# Altium schematic sheet (2) Controller A20_ESP32.SchDoc
size 355 x 228 mm; SheetNumber: 2; SheetTotal: 6
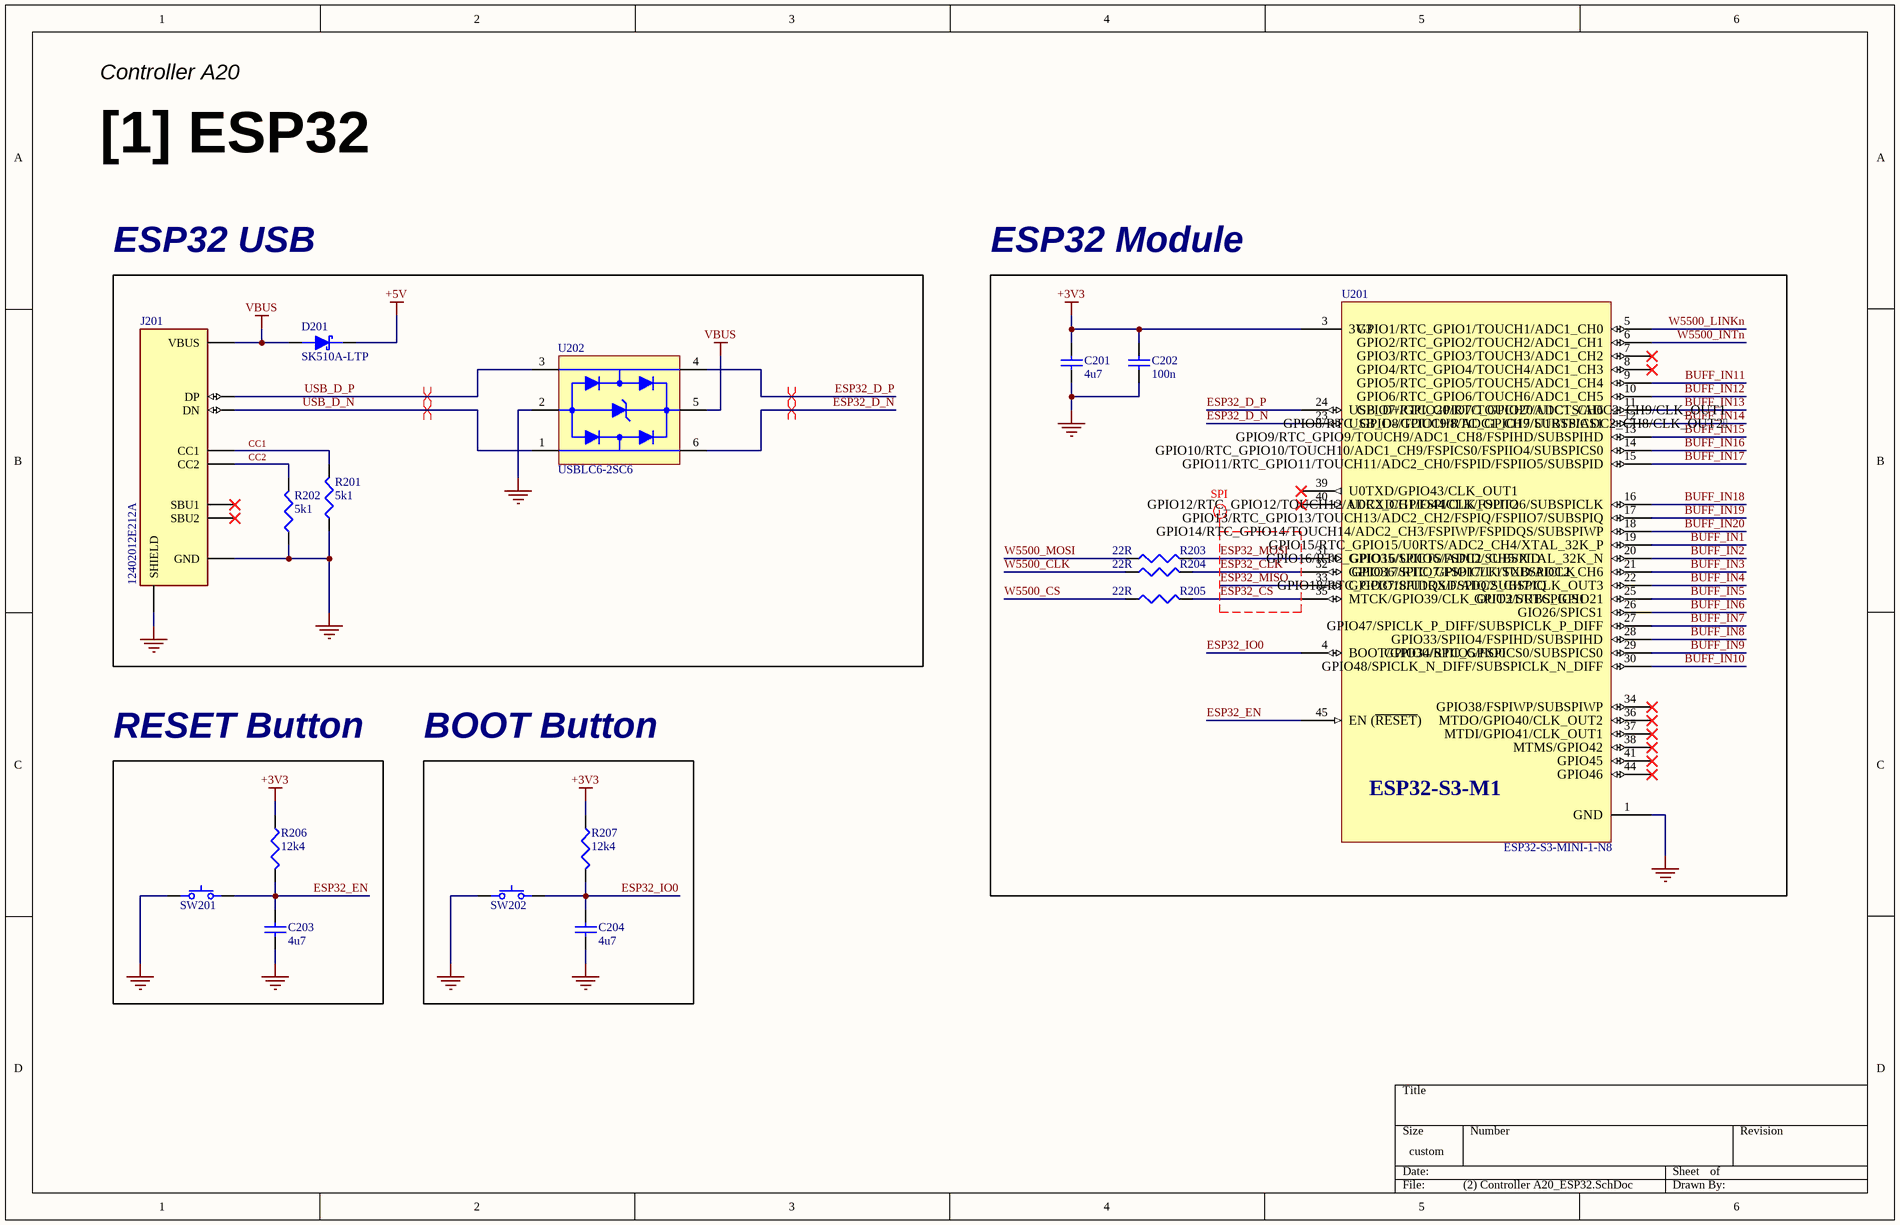
[diagram p0: (2) Controller A20_ESP32.SchDoc]

## Parts
C201  4u7  [C0805]
C202  100n  [C0603]
C203  4u7  [C0805]
C204  4u7  [C0805]
D201  SK510A-LTP  [DO-214AC(SMA)]
J201  12402012E212A  [USB-C Female 16P]
R201  5k1  [R0603]
R202  5k1  [R0603]
R203  22R  [R0402]
R204  22R  [R0402]
R205  22R  [R0402]
R206  12k4  [R0603]
R207  12k4  [R0603]
SW201  SKRPANE010  [SMD Tactile Switch]  (value not drawn)
SW202  SKRPANE010  [SMD Tactile Switch]  (value not drawn)
U201  ESP32-S3-MINI-1-N8  [ESP32-S3-MINI-1-N8]
U202  USBLC6-2SC6  [SOT23-6L]

## Blocks framed on the sheet
ESP32 USB: D201 J201 R201 R202 U202
ESP32 Module: C201 C202 R203-R205 U201
RESET Button: C203 R206 SW201
BOOT Button: C204 R207 SW202

## Nets
+3V3: C201.2 C202.2 R206.2 R207.2 U201.3(3V3)
+5V: D201.2
GND: C201.1 C202.1 C203.1 C204.1 J201.A1B12/B1A12(GND) J201.SH(SHIELD) R201.1 R202.1 SW201.2 SW202.2 U201.1(GND) U202.2
VBUS: D201.1 J201.A4B9/_B4A9(VBUS) U202.5
BUFF_IN1: U201.19(GPIO15/RTC_GPIO15/U0RTS/ADC2_CH4/XTAL_32K_P)
BUFF_IN2: U201.20(GPIO16/RTC_GPIO16/U0CTS/ADC2_CH5/XTAL_32K_N)
BUFF_IN3: U201.21(GPIO17/RTC_GPIO17/U1TXD/ADC2_CH6)
BUFF_IN4: U201.22(GPIO18/RTC_GPIO18/U1RXD/ADC2_CH7/CLK_OUT3)
BUFF_IN5: U201.25(GPIO21/RTC_GPIO21)
BUFF_IN6: U201.26(GIO26/SPICS1)
BUFF_IN7: U201.27(GPIO47/SPICLK_P_DIFF/SUBSPICLK_P_DIFF)
BUFF_IN8: U201.28(GPIO33/SPIIO4/FSPIHD/SUBSPIHD)
BUFF_IN9: U201.29(GPIO34/SPIIO5/FSPICS0/SUBSPICS0)
BUFF_IN10: U201.30(GPIO48/SPICLK_N_DIFF/SUBSPICLK_N_DIFF)
BUFF_IN11: U201.9(GPIO5/RTC_GPIO5/TOUCH5/ADC1_CH4)
BUFF_IN12: U201.10(GPIO6/RTC_GPIO6/TOUCH6/ADC1_CH5)
BUFF_IN13: U201.11(GPIO7/RTC_GPIO7/TOUCH7/ADC1_CH6)
BUFF_IN14: U201.12(GPIO8/RTC_GPIO8/TOUCH8/ADC1_CH7/SUBSPICS1)
BUFF_IN15: U201.13(GPIO9/RTC_GPIO9/TOUCH9/ADC1_CH8/FSPIHD/SUBSPIHD)
BUFF_IN16: U201.14(GPIO10/RTC_GPIO10/TOUCH10/ADC1_CH9/FSPICS0/FSPIIO4/SUBSPICS0)
BUFF_IN17: U201.15(GPIO11/RTC_GPIO11/TOUCH11/ADC2_CH0/FSPID/FSPIIO5/SUBSPID)
BUFF_IN18: U201.16(GPIO12/RTC_GPIO12/TOUCH12/ADC2_CH1/FSPICLK/FSPIIO6/SUBSPICLK)
BUFF_IN19: U201.17(GPIO13/RTC_GPIO13/TOUCH13/ADC2_CH2/FSPIQ/FSPIIO7/SUBSPIQ)
BUFF_IN20: U201.18(GPIO14/RTC_GPIO14/TOUCH14/ADC2_CH3/FSPIWP/FSPIDQS/SUBSPIWP)
CC1: J201.A5(CC1) R201.2
CC2: J201.B5(CC2) R202.2
ESP32_CLK: R204.2 U201.32(GPIO36/SPIIO7/FSPICLK/SUBSPICLK)
ESP32_CS: R205.2 U201.35(MTCK/GPIO39/CLK_OUT3/SUBSPICS1)
ESP32_D_N: U201.23(USB_D-/GPIO19/RTC_GPIO19/U1RTS/ADC2_CH8/CLK_OUT2) U202.6
ESP32_D_P: U201.24(USB_D+/GPIO20/RTC_GPIO20/U1CTS/ADC2_CH9/CLK_OUT1) U202.4
ESP32_EN: C203.2 R206.1 SW201.1 U201.45(EN_(~{RESET}))
ESP32_IO0: C204.2 R207.1 SW202.1 U201.4(BOOT/GPIO0/RTC_GPIO0)
ESP32_MISO: U201.33(GPIO37/SPIDQS/FSPIQ/SUBSPIQ)
ESP32_MOSI: R203.2 U201.31(GPIO35/SPIIO6/FSPID/SUBSPID)
USB_D_N: J201.A7/B7(DN) U202.1
USB_D_P: J201.A6/B6(DP) U202.3
W5500_CLK: R204.1
W5500_CS: R205.1
W5500_INTn: U201.6(GPIO2/RTC_GPIO2/TOUCH2/ADC1_CH1)
W5500_LINKn: U201.5(GPIO1/RTC_GPIO1/TOUCH1/ADC1_CH0)
W5500_MOSI: R203.1

Not connected (* = marked no-connect by the designer): J201 A8(SBU1)* B8(SBU2)*; U201 7(GPIO3/RTC_GPIO3/TOUCH3/ADC1_CH2)* 8(GPIO4/RTC_GPIO4/TOUCH4/ADC1_CH3)* 34(GPIO38/FSPIWP/SUBSPIWP)* 36(MTDO/GPIO40/CLK_OUT2)* 37(MTDI/GPIO41/CLK_OUT1)* 38(MTMS/GPIO42)* 39(U0TXD/GPIO43/CLK_OUT1)* 40(U0RXD/GPIO44/CLK_OUT2)* 41(GPIO45)* 44(GPIO46)*

## Layout directives
differential pair; differential pair class USB90: USB_D_P
differential pair; differential pair class USB90; rule Impedance Constraint [Min = 85.00    Max = 95.00    ]: ESP32_D_N, ESP32_D_P, USB_D_N, USB_D_P
rule Impedance Constraint [Min = 45.00    Max = 55.00    ]; net class SPI: ESP32_CLK, ESP32_CS, ESP32_MISO, ESP32_MOSI

## Notes on the sheet
- Controller A20
- [1] ESP32
- (in symbol ESP32-S3-MINI-1-N8) ESP32-S3-M1

## Library data of the parts
C201 C203 C204 = CAP 4.7uF 50V: 4.7 µF ±20% 50V Ceramic Capacitor X7R 0805 (2012 Metric); Manufacturer: Murata Electronics; Mfr. Part #: GRM21BZ71H475ME15K; Qty.: 1; Ext. Price: 0.27; Supplier: DigiKey; Supplier Part #: 490-GRM21BZ71H475ME15KCT-ND; Package: 0805; Unit Price: 0.27; ComponentLink1Description: Datasheet; ComponentLink1URL: https://search.murata.co.jp/Ceramy/image/img/A01X/G101/ENG/GRM21BZ71H475ME15-01.pdf; ComponentLink2Description: Distributor Link; ComponentLink2URL: https://www.digikey.com/en/products/detail/murata-electronics/GRM21BZ71H475ME15K/13904866
C202 = CAP 100nF 50V: 0.1 µF ±10% 50V Ceramic Capacitor X7R 0603 (1608 Metric); Manufacturer: KEMET; Mfr. Part #: C0603C104K5RACTU; Qty.: 10; Ext. Price: 0.11; Supplier: DigiKey; Supplier Part #: 399-C0603C104K5RACTUCT-ND; Package: 0603; Unit Price: 0.011; ComponentLink1Description: Datasheet; ComponentLink1URL: https://www.yageogroup.com/content/datasheet/asset/file/KEM_C1002_X7R_SMD; ComponentLink2Description: Distributor Link; ComponentLink2URL: https://www.digikey.com/en/products/detail/kemet/C0603C104K5RACTU/1465594
D201 = SK510A-LTP 100V 5A Schottky Diode: Diode 100 V 5A Surface Mount DO-214AC (SMA); Manufacturer: MCC (Micro Commercial Components); Qty.: 1; Ext. Price: 0.5; Mfr. Part #: SK510A-LTP; Supplier: DigiKey; Supplier Part #: SK510A-LTPMSCT-ND; Package: DO-214AC(SMA); Unit Price: 0.5; ComponentLink1Description: Datasheet; ComponentLink1URL: https://www.mccsemi.com/pdf/Products/SK52A-L_SK5200A-L(SMA).pdf; ComponentLink2Description: Distributor Link; ComponentLink2URL: https://www.digikey.com/en/products/detail/mcc-micro-commercial-components/SK510A-LTP/5114130
J201 = USB2.0 Type-C Connector: USB-C (USB TYPE-C) USB 2.0 Receptacle Connector 24 (16+8 Dummy) Position Surface Mount, Right Angle; Through Hole; Manufacturer: Amphenol ICC (Commercial Products); Qty.: 1; Ext. Price: 0.61; Mfr. Part #: 12402012E212A; Supplier: DigiKey; Supplier Part #: 664-12402012E212ACT-ND; Package: SMD; Unit Price: 0.61; ComponentLink1Description: Datasheet; ComponentLink1URL: https://cdn.amphenol-cs.com/media/wysiwyg/files/drawing/12402012-10.pdf; ComponentLink2Description: Distributor Link; ComponentLink2URL: https://www.digikey.com/en/products/detail/amphenol-cs-commercial-products/12402012E212A/13683192?s=N4IgTCBcDaIIxgCwAYzIQUTAggiAugL5A
R201 R202 = RES 5.1k: 5.1 kOhms ±1% 0.1W, 1/10W Chip Resistor 0603 (1608 Metric) Moisture Resistant Thick Film; Manufacturer: YAGEO; Mfr. Part #: RC0603FR-075K1L; Qty.: 10; Ext. Price: 0.07; Supplier: DigiKey; Supplier Part #: 311-5.10KHRCT-ND; Package: 0603; Unit Price: 0.007; ComponentLink1Description: Datasheet; ComponentLink1URL: https://www.yageogroup.com/content/datasheet/asset/file/PYU-RC_GROUP_51_ROHS_L; ComponentLink2Description: Distributor Link; ComponentLink2URL: https://www.digikey.com/en/products/detail/yageo/RC0603FR-075K1L/727268
R203-R205 = RES 22R: 22 Ohms ±1% 0.063W, 1/16W Chip Resistor 0402 (1005 Metric) Moisture Resistant Thick Film; Manufacturer: YAGEO; Mfr. Part #: RC0402FR-0722RL; Qty.: 10; Ext. Price: 0.07; Supplier: DigiKey; Supplier Part #: 311-22.0LRCT-ND; Package: 0402; Unit Price: 0.007; ComponentLink1Description: Datasheet; ComponentLink1URL: https://www.yageogroup.com/content/datasheet/asset/file/PYU-RC_GROUP_51_ROHS_L; ComponentLink2Description: Distributor Link; ComponentLink2URL: https://www.digikey.com/en/products/detail/yageo/RC0402FR-0722RL/726562
R206 R207 = RES 12.4k: 12.4 kOhms ±1% 0.1W, 1/10W Chip Resistor 0603 (1608 Metric) Moisture Resistant Thick Film; Manufacturer: YAGEO; Mfr. Part #: RC0603FR-0712K4L; Qty.: 10; Ext. Price: 0.07; Supplier: DigiKey; Supplier Part #: 311-12.4KHRCT-ND; Package: 0603; Unit Price: 0.007; ComponentLink1Description: Datasheet; ComponentLink1URL: https://www.yageogroup.com/content/datasheet/asset/file/PYU-RT_1-TO-0-01_ROHS_L; ComponentLink2Description: Distributor Link; ComponentLink2URL: https://www.digikey.com/en/products/detail/yageo/RC0603FR-0712K4L/726917
SW201 SW202 = Tactile Switch: Without Bracket 3.2mm 2.5mm Oval Button Surface Mount,Vertical 4.2mm SPST 1,000,000 Cycles 16V 1.57N SMD Tactile Switches ROHS; Manufacturer: ALPSALPINE; Qty.: 1; Ext. Price: 0.27; Mfr. Part #: SKRPANE010; Supplier: DigiKey; Supplier Part #: 4809-SKRPANE010CT-ND; Package: SMD; Unit Price: 0.27; ComponentLink1Description: Datasheet; ComponentLink1URL: https://tech.alpsalpine.com/cms.media/product_spec_skrpane010_en_1e0076b4ef.pdf; ComponentLink2Description: Distributor Link; ComponentLink2URL: https://www.digikey.com/en/products/detail/alps-alpine/SKRPANE010/26519635?s=N4IgTCBcDaIMoGkBKAFAggOQKIAYCMOIAugL5A
U201 = ESP32-S3-MINI-1-N8: Small-sized module supporting 2.4 GHz Wi-Fi (802.11b/g/n) and Bluetooth® 5 / Built around ESP32-S3 series of SoCs, Xtensa® dual-core 32-bit LX7 microprocessor. / Flash up to 8 MB, optional 2 MB PSRAM in chip package. / 39 GPIOs, rich set of peripherals; Manufacturer: Espressif Systems; Qty.: 1; Ext. Price: 5.28; Mfr. Part #: ESP32-S3-MINI-1-N8; Supplier: DigiKey; Supplier Part #: 5407-ESP32-S3-MINI-1-N8CT-ND; Package: SMD; Unit Price: 5.28; ComponentLink1Description: Datasheet; ComponentLink1URL: https://documentation.espressif.com/esp32-s3-mini-1_mini-1u_datasheet_en.pdf; ComponentLink2Description: Distributor Link; ComponentLink2URL: https://www.digikey.com/en/products/detail/espressif-systems/ESP32-S3-MINI-1-N8/15295890
U202 = USBLC6-2SC6 ESD Array 5.25VRWM: 17V Clamp 5A (8/20µs) Ipp Tvs Diode Surface Mount SOT-23-6; Manufacturer: STMicroelectronics; Qty.: 1; Ext. Price: 0.36; Mfr. Part #: USBLC6-2SC6; Supplier: DigiKey; Supplier Part #: 497-5235-1-ND; Package: SOT-23-6L; Unit Price: 0.36; ComponentLink1Description: Datasheet; ComponentLink1URL: https://www.st.com/content/ccc/resource/technical/document/datasheet/06/1d/48/9c/6c/20/4a/b2/CD00050750.pdf/files/CD00050750.pdf/jcr:content/translations/en.CD00050750.pdf; ComponentLink2Description: Distributor Link; ComponentLink2URL: https://www.digikey.com/en/products/detail/stmicroelectronics/USBLC6-2SC6/1040559